# EAGLE design Un_C8051F340_V2.0 (EAGLE 6.6.0)
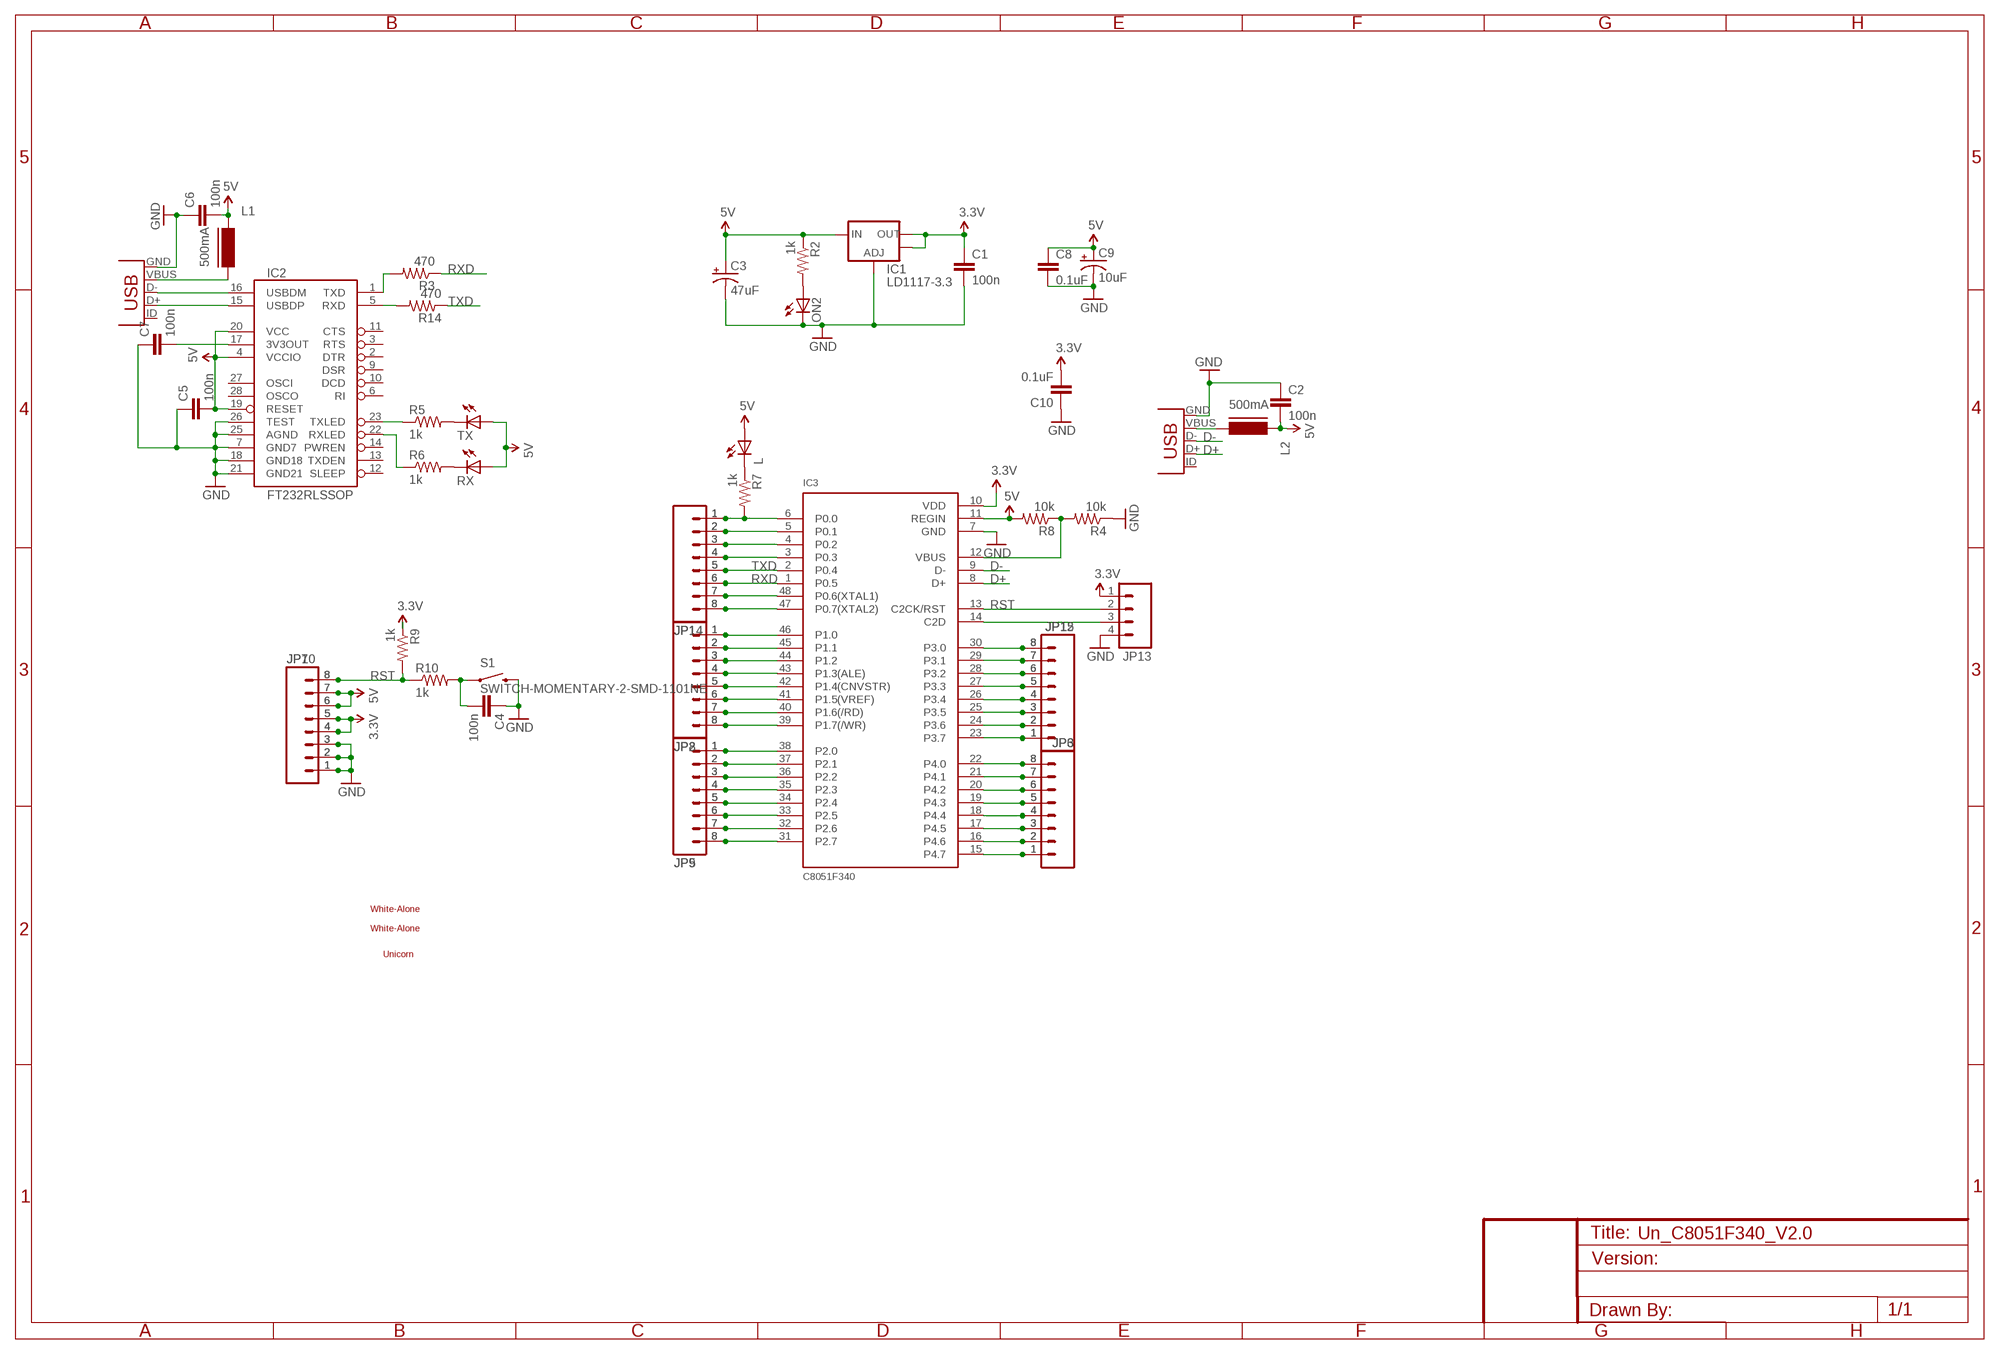
[diagram p0: schematic, sheet 1]

## Parts
C1  100n  CAP0603-CAP  [0603-CAP]
C2  100n  CAP0603-CAP  [0603-CAP]
C3  47uF  CAP_POLD  [PANASONIC_D]
C4  100n  CAP0603-CAP  [0603-CAP]
C5  100n  CAP0603-CAP  [0603-CAP]
C6  100n  CAP0603-CAP  [0603-CAP]
C7  100n  CAP0603-CAP  [0603-CAP]
C8  0.1uF  CAP0603-CAP  [0603-CAP]
C9  10uF  CAP_POL1206  [EIA3216]
C10  0.1uF  CAP0603-CAP  [0603-CAP]
IC1  LD1117-3.3  V_REG_LM1117SOT223  [SOT223]
IC2  FT232RLSSOP  [SSOP28DB]
IC3  C8051F340  [TQFP48]
JP1  M08  [1X08]
JP2  M08  [1X08]
JP3  M08  [1X08]
JP5  M08  [1X08]
JP6  M08  [1X08]
JP7  M08  [1X08]
JP8  M08  [1X08]
JP9  M08  [1X08]
JP10  M08  [1X08]
JP12  M08  [1X08]
JP13  M04PTH  [1X04]
JP14  M08  [1X08]
JP15  M08  [1X08]
L  LED0805  [LED-0805]
L1  500mA  FERRITE-0805  [FB805]
L2  500mA  FERRITE-0805  [FB805]
ON2  LED0805  [LED-0805]
R2  1k  RESISTOR0603-RES  [0603-RES]
R3  470  RESISTOR0603-RES  [0603-RES]
R4  10k  RESISTOR0603-RES  [0603-RES]
R5  1k  RESISTOR0603-RES  [0603-RES]
R6  1k  RESISTOR0603-RES  [0603-RES]
R7  1k  RESISTOR0603-RES  [0603-RES]
R8  10k  RESISTOR0603-RES  [0603-RES]
R9  1k  RESISTOR0603-RES  [0603-RES]
R10  1k  RESISTOR0603-RES  [0603-RES]
R14  470  RESISTOR0603-RES  [0603-RES]
RX  LED0805  [LED-0805]
S1  SWITCH-MOMENTARY-2-SMD-1101NE  [TACTILE-SWITCH-1101NE]
TX  LED0805  [LED-0805]
U$3  UNICORN_2  [UNICORN_2]
U$7  WHITE-ALONE_0  [WHITE-ALONE_0]
U$11  WHITE-ALONE_0  [WHITE-ALONE_0]
X1  USBSMD  [USB-MINIB]
X2  USBSMD  [USB-MINIB]

## Nets
3.3V: C1.1 C10.2 IC1.2(OUT) IC1.4(OUT) IC3.10(VDD) JP7.4 JP7.5 JP10.4 JP10.5 JP13.1 R9.1
5V [usbvcc]: C2.2 C3.+ C5.2 C6.2 C8.1 C9.A(+) IC1.3(IN) IC2.4(VCCIO) IC2.19(RESET) IC2.20(VCC) IC3.11(REGIN) JP7.6 JP7.7 JP10.6 JP10.7 L1.1 L2.1 L.1(A) R2.1 R8.2 RX.1(A) TX.1(A)
D+: IC3.8(D+) X1.D+
D-: IC3.9(D-) X1.D-
GND [gnd]: C1.2 C2.1 C3.- C4.1 C5.1 C6.1 C7.1 C8.2 C9.C(-) C10.1 IC1.1(ADJ) IC2.7(GND7) IC2.18(GND18) IC2.21(GND21) IC2.25(AGND) IC2.26(TEST) IC3.7(GND) JP7.1 JP7.2 JP7.3 JP10.1 JP10.2 JP10.3 JP13.4 ON2.2(C) R4.1 S1.P$2 X1.GND X2.GND
MISO: IC3.41(P1.5(VREF)) JP2.6 JP8.6
MISO1: IC3.33(P2.5) JP5.6 JP9.6
MISO2: IC3.28(P3.2) JP12.6 JP15.6
MOSI: IC3.42(P1.4(CNVSTR)) JP2.5 JP8.5
MOSI1: IC3.34(P2.4) JP5.5 JP9.5
MOSI2: IC3.27(P3.3) JP12.5 JP15.5
N$1: IC3.6(P0.0) JP1.1 JP14.1 R7.2
N$2: IC3.5(P0.1) JP1.2 JP14.2
N$3: L1.2 X2.VBUS
N$4: IC3.12(VBUS) R4.2 R8.1
N$5: IC2.16(USBDM) X2.D-
N$6: IC2.15(USBDP) X2.D+
N$7: IC2.23(TXLED) R5.1
N$8: R5.2 TX.2(C)
N$9: R6.2 RX.2(C)
N$10: IC2.22(RXLED) R6.1
N$11: IC3.22(P4.0) JP3.8 JP6.8
N$12: IC3.4(P0.2) JP1.3 JP14.3
N$13: IC3.3(P0.3) JP1.4 JP14.4
N$14: IC3.48(P0.6(XTAL1)) JP1.7 JP14.7
N$15: IC3.21(P4.1) JP3.7 JP6.7
N$16: IC3.39(P1.7(/WR)) JP2.8 JP8.8
N$17: IC3.47(P0.7(XTAL2)) JP1.8 JP14.8
N$18: IC3.45(P1.1) JP2.2 JP8.2
N$19: IC3.46(P1.0) JP2.1 JP8.1
N$20: IC3.14(C2D) JP13.3
N$21: L.2(C) R7.1
N$22: C7.2 IC2.17(3V3OUT)
N$23: C4.2 R10.2 S1.P$1
N$24: IC3.17(P4.5) JP3.3 JP6.3
N$25: IC3.18(P4.4) JP3.4 JP6.4
N$26: IC3.19(P4.3) JP3.5 JP6.5
N$27: IC3.20(P4.2) JP3.6 JP6.6
N$28: ON2.1(A) R2.2
N$29: IC3.44(P1.2) JP2.3 JP8.3
N$30: IC3.31(P2.7) JP5.8 JP9.8
N$32: L2.2 X1.VBUS
N$33: IC3.36(P2.2) JP5.3 JP9.3
N$34: IC3.37(P2.1) JP5.2 JP9.2
N$35: IC2.5(RXD) R14.2
N$36: IC3.38(P2.0) JP5.1 JP9.1
N$37: IC2.1(TXD) R3.2
N$38: IC3.35(P2.3) JP5.4 JP9.4
N$42: IC3.30(P3.0) JP12.8 JP15.8
N$43: IC3.25(P3.5) JP12.3 JP15.3
N$44: IC3.24(P3.6) JP12.2 JP15.2
N$45: IC3.23(P3.7) JP12.1 JP15.1
N$46: IC3.26(P3.4) JP12.4 JP15.4
N$48: IC3.43(P1.3(ALE)) JP2.4 JP8.4
P4_6: IC3.16(P4.6) JP3.2 JP6.2
P4_7: IC3.15(P4.7) JP3.1 JP6.1
RST: IC3.13(C2CK/RST) JP7.8 JP10.8 JP13.2 R9.2 R10.1
RXD: IC3.1(P0.5) JP1.6 JP14.6 R3.1
SCK: IC3.40(P1.6(/RD)) JP2.7 JP8.7
SCK1: IC3.32(P2.6) JP5.7 JP9.7
SCK2: IC3.29(P3.1) JP12.7 JP15.7
TXD: IC3.2(P0.4) JP1.5 JP14.5 R14.1
Unconnected: IC2.2(DTR) IC2.3(RTS) IC2.6(RI) IC2.9(DSR) IC2.10(DCD) IC2.11(CTS) IC2.12(SLEEP) IC2.13(TXDEN) IC2.14(PWREN) IC2.27(OSCI) IC2.28(OSCO) X1.ID(USBID) X2.ID(USBID)

## Library data of the parts
C1 C5-C8 C10 = 2SparkFun:CAP: Capacitor Standard 0603 ceramic capacitor, and 0.1" leaded capacitor.
C2 C4 = 1SparkFun:CAP: Capacitor Standard 0603 ceramic capacitor, and 0.1" leaded capacitor.
C3 C9 = 2SparkFun:CAP_POL: Capacitor Polarized These are standard SMD and PTH capacitors. Normally 10uF, 47uF, and 100uF in electrolytic and tantalum varieties. Always verify the external diameter of the through hole cap, it varies with capacity, voltage, and manufacturer. The EIA devices should be standard.
IC1 = 1SparkFun:V_REG_LM1117: Voltage Regulator LM1117 Standard adjustable voltage regulator but in SMD form. Spark Fun Electronics SKU : COM-00595
IC2 = 1SparkFun:FT232RL: USB UART FT232RL 4th Generation USB UART (USB <-> Serial) Controller. Spark Fun Electronics SKU : COM-00650
IC3 = 2SparkFun:C8051F340: Full Speed USB Flash MCU
JP1-JP3 JP5-JP10 JP12 JP14 JP15 = 1SparkFun:M08: Header 8 Standard 8-pin 0.1" header. Use with straight break away headers (SKU : PRT-00116), right angle break away headers (PRT-00553), swiss pins (PRT-00743), machine pins (PRT-00117), and female headers (PRT-00115).
JP13 = 2SparkFun:M04: Header 4 Standard 4-pin 0.1" header. Use with straight break away headers (SKU : PRT-00116), right angle break away headers (PRT-00553), swiss pins (PRT-00743), machine pins (PRT-00117), and female headers (PRT-00115). Molex polarized connector foot print use with SKU : PRT-08231 with associated crimp pins and housings. 1MM SMD Version SKU: PRT-10208
L ON2 RX TX = 1SparkFun:LED: LEDs Standard schematic elements and footprints for 5mm, 3mm, 1206, and 0603 sized LEDs. 5mm - Spark Fun Electronics SKU : COM-00529 (and others)
L1 L2 = 2SparkFun:FERRITE: Ferrite bead in various packages
R2-R10 R14 = 2SparkFun:RESISTOR: Resistor Basic schematic elements and footprints for 0603, 1206, and PTH resistors.
S1 = 2SparkFun:SWITCH-MOMENTARY-2
U$3 = 2SparkFun:UNICORN
U$7 U$11 = 2SparkFun:WHITE-ALONE
X1 X2 = 2SparkFun:USB: USB Connectors USB-B-PTH is fully proven SKU : PRT-00139 USB-miniB is fully proven SKU : PRT-00587 USB-A-PCB is untested. USB-A-H is throughly reviewed, but untested. Spark Fun Electronics SKU : PRT-00437 USB-B-SMT is throughly reviewed, but untested. Needs silkscreen touching up. USB-A-S has not been used/tested USB-MB-H has not been used/tested

## Net classes
0 default: width 0.254 mm, clearance 0.254 mm
1 power: width 0.61 mm, drill 0.61 mm, clearance 0.254 mm
2 gnd: width 0.305 mm, drill 0.381 mm, clearance 0.254 mm
3 usbvcc: width 0.508 mm, drill 0.61 mm, clearance 0.254 mm
4 aref: width 0.406 mm, drill 0.61 mm, clearance 0.254 mm

## Board
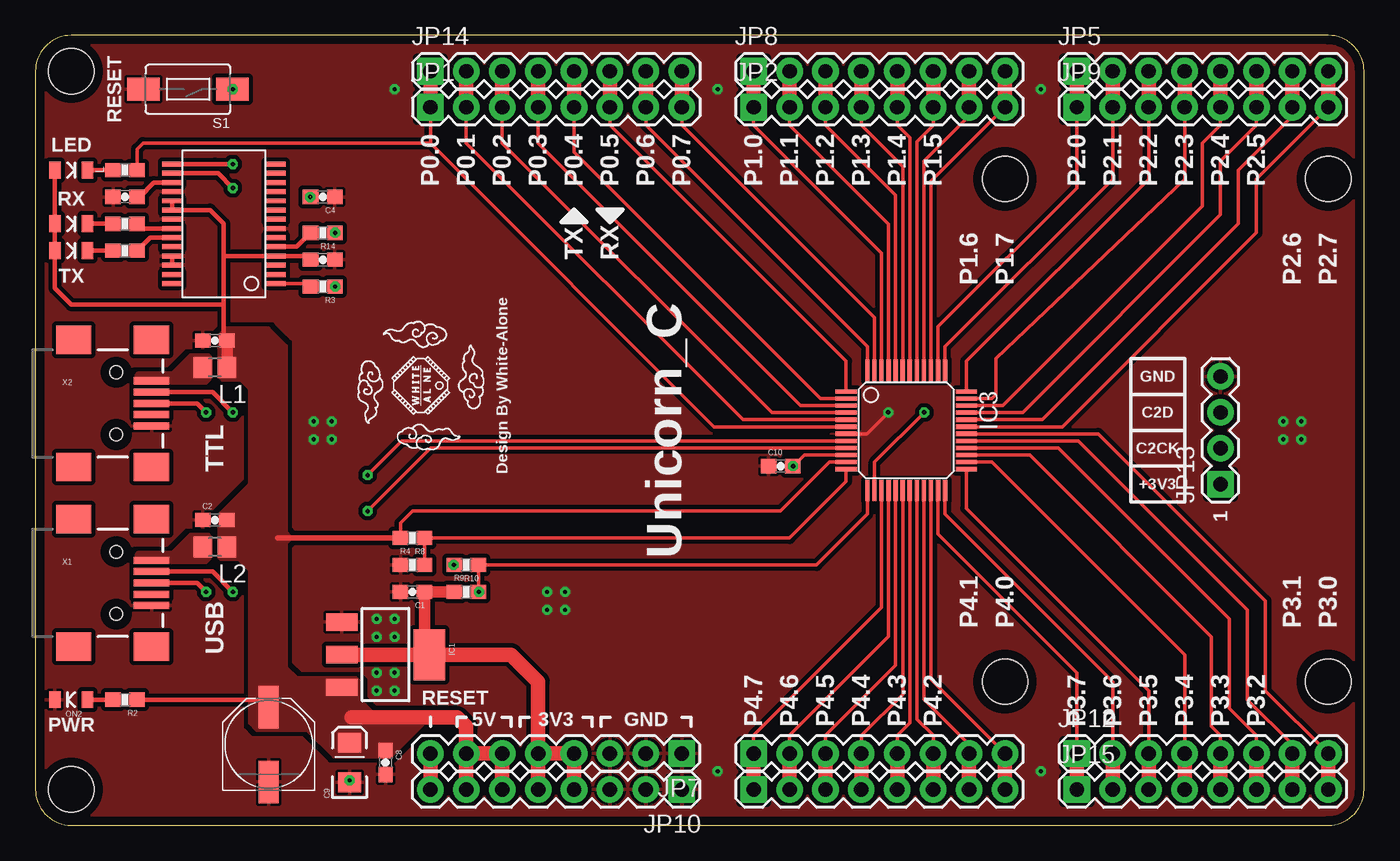
[diagram p1: board, top side]
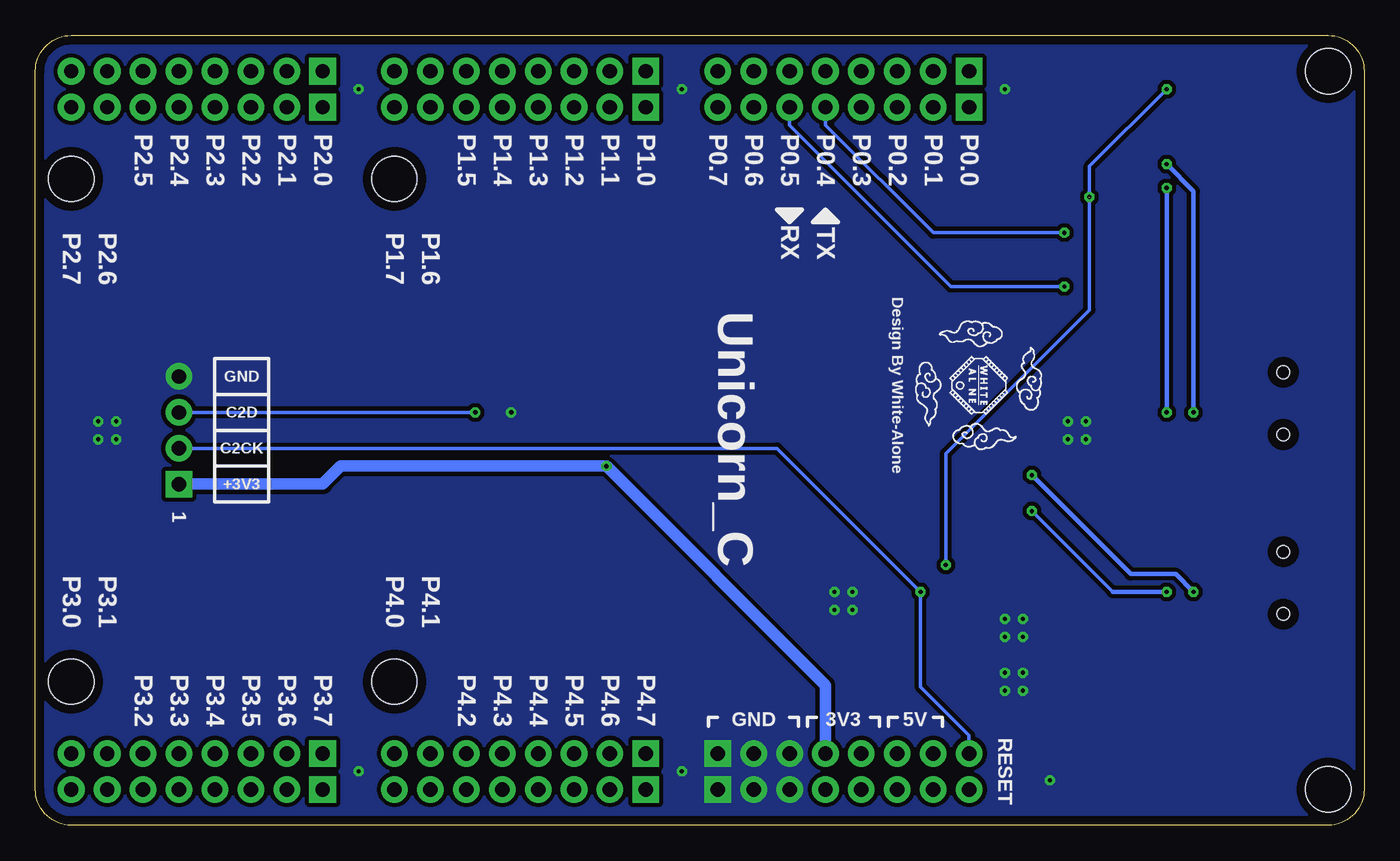
[diagram p2: board, bottom side, seen from below]

Size 93.98 x 55.88 mm. Coordinates in mm from the lower left corner, seen from the top.
Copper layers (1*16): Top 0.035mm / dielectric 1.5mm / Bottom 0.035mm
Design rules "yun": minimum track width 8mil, minimum drill 15mil, track to track 8mil, track to pad 8mil, pad to pad 8mil, via to via 8mil, smd to smd 8mil, copper to edge 25mil, drill to drill 8mil, minimum pad ring 10mil, minimum via ring 8mil, stop-mask expansion 4mil, vias tented up to drill 20mil, thermal gap 8mil

### Footprints (pad centres in the part's own frame; a part is rotated, then mirrored left to right if it is on the bottom)
0603-CAP = smd 1.1 x 1: 1 -0.85,0; 2 0.85,0
PANASONIC_D = smd 3 x 1.4: + 2.654,0; - -2.654,0
EIA3216 = smd 1.4 x 1.6: A 1.4,0; C -1.4,0
SOT223 = smd 1.219 x 2.235: 1 -2.311,-3.099; 2 0,-3.099; 3 2.311,-3.099 | smd 3.6 x 2.2: 4 0,3.099
SSOP28DB = smd 0.348 x 1.397: 1 -4.225,-3.656; 2 -3.575,-3.656; 3 -2.925,-3.656; 4 -2.275,-3.656; 5 -1.625,-3.656; 6 -0.975,-3.656; 7 -0.325,-3.656; 8 0.325,-3.656; 9 0.975,-3.656; 10 1.625,-3.656; 11 2.275,-3.656; 12 2.925,-3.656; 13 3.575,-3.656; 14 4.225,-3.656; 15 4.225,3.656; 16 3.575,3.656; 17 2.925,3.656; 18 2.275,3.656; 19 1.625,3.656; 20 0.975,3.656; 21 0.325,3.656; 22 -0.325,3.656; 23 -0.975,3.656; 24 -1.625,3.656; 25 -2.275,3.656; 26 -2.925,3.656; 27 -3.575,3.656; 28 -4.225,3.656
TQFP48 = smd 0.3 x 1.5: 1 -2.75,-4.25; 2 -2.25,-4.25; 3 -1.75,-4.25; 4 -1.25,-4.25; 5 -0.75,-4.25; 6 -0.25,-4.25; 7 0.25,-4.25; 8 0.75,-4.25; 9 1.25,-4.25; 10 1.75,-4.25; 11 2.25,-4.25; 12 2.75,-4.25; 25 2.75,4.25; 26 2.25,4.25; 27 1.75,4.25; 28 1.25,4.25; 29 0.75,4.25; 30 0.25,4.25; 31 -0.25,4.25; 32 -0.75,4.25; 33 -1.25,4.25; 34 -1.75,4.25; 35 -2.25,4.25; 36 -2.75,4.25 | smd 1.5 x 0.3: 13 4.25,-2.75; 14 4.25,-2.25; 15 4.25,-1.75; 16 4.25,-1.25; 17 4.25,-0.75; 18 4.25,-0.25; 19 4.25,0.25; 20 4.25,0.75; 21 4.25,1.25; 22 4.25,1.75; 23 4.25,2.25; 24 4.25,2.75; 37 -4.25,2.75; 38 -4.25,2.25; 39 -4.25,1.75; 40 -4.25,1.25; 41 -4.25,0.75; 42 -4.25,0.25; 43 -4.25,-0.25; 44 -4.25,-0.75; 45 -4.25,-1.25; 46 -4.25,-1.75; 47 -4.25,-2.25; 48 -4.25,-2.75
1X08 = drill 1.016 pad 1.88 square: 1 0,0 | drill 1.016 pad 1.88: 2 2.54,0; 3 5.08,0; 4 7.62,0; 5 10.16,0; 6 12.7,0; 7 15.24,0; 8 17.78,0
1X04 = drill 1 pad 1.88 square: 1 0,0 | drill 1 pad 1.88: 2 2.54,0; 3 5.08,0; 4 7.62,0
LED-0805 = smd 0.8 x 1.2: 1 -1.154,0; 2 1.154,0
FB805 = smd 1.3 x 1.5: 1 -0.85,0; 2 0.85,0
0603-RES = smd 1.1 x 1: 1 -0.85,0; 2 0.85,0
TACTILE-SWITCH-1101NE = smd 2.3 x 1.6: P$1 -3.15,0; P$2 3.15,0
UNICORN_2 = hole 3.2: -33.02,-25.4; 33.02,17.78; 33.02,-17.78; -33.02,25.4; 55.88,17.78; 55.88,-17.78
USB-MINIB = smd 2.5 x 0.5: D+ 2.5,0; D- 2.5,0.8; GND 2.5,-1.6; ID 2.5,-0.8; VBUS 2.5,1.6 | smd 2.5 x 2: MTN1 -3,4.5; MTN2 2.5,4.5; MTN3 -3,-4.5; MTN4 2.5,-4.5 | hole 0.9: 0,2.2; 0,-2.2

### Placement (x,y rotation side)
C1  26.67,16.51 180 top
C2  12.7,21.59 0 top
C3  16.51,5.71 90 top
C4  20.32,44.45 180 top
C5  20.32,40.01 180 top
C6  12.7,34.29 0 top
C7  6.35,44.45 0 top
C8  24.77,4.45 270 top
C9  22.23,4.45 90 top
C10  52.7,25.4 0 top
IC1  24.77,12.06 270 top
IC2  13.34,42.55 90 top
IC3  61.59,27.94 270 top
JP1  27.94,50.8 0 top
JP2  50.8,50.8 0 top
JP3  50.8,2.54 0 top
JP5  73.66,53.34 0 top
JP6  50.8,5.08 0 top
JP7  45.72,5.08 180 top
JP8  50.8,53.34 0 top
JP9  73.66,50.8 0 top
JP10  45.72,2.54 180 top
JP12  73.66,5.08 0 top
JP13  83.82,24.13 90 top
JP14  27.94,53.34 0 top
JP15  73.66,2.54 0 top
L  2.54,46.35 0 top
L1  12.7,32.38 180 top
L2  12.7,19.68 180 top
ON2  2.54,8.89 180 top
R2  6.35,8.89 180 top
R3  20.32,38.1 180 top
R4  26.67,18.41 0 top
R5  6.35,40.64 180 top
R6  6.35,42.55 180 top
R7  6.35,46.35 0 top
R8  26.67,20.32 180 top
R9  30.48,16.51 0 top
R10  30.48,18.41 180 top
R14  20.32,41.91 180 top
RX  2.54,42.55 0 top
S1  10.79,52.07 180 top
TX  2.54,40.64 0 top
U$3  35.56,27.94 0 top
U$7  27.3,31.11 90 top
U$11  27.3,31.11 270 bottom
X1  5.71,17.14 0 top
X2  5.71,29.84 0 top

### Tracks (layer width: path | path; a pad name or v marks a point on that pad's centre or on a via)
3.3V  (via drill 0.3)
  Top 0.254: C10.2 v53.59,25.4 54.38,26.19 IC3.10
  Top 0.813: 27.3,12.06 27.52,12.28 C1.1 R9.1
  Top 1.016: IC1.2 27.3,12.06 IC1.4 33.66,12.06 35.56,10.16 JP7.5 | JP7.5 JP7.4 JP10.4 | JP10.5 JP7.5
  Bottom 0.813: JP13.1 73.66,24.13 72.39,25.4 v53.59,25.4 38.1,9.91 JP7.4
5V
  Top 0.254: IC3.11 56.17,25.69 52.7,22.23 26.67,22.23 25.82,21.38 R8.2
  Top 0.305: C5.2 19.2,40.27 IC2.4 13.34,40.27 | IC2.19 IC2.20 12.36,43.52 13.34,42.55 13.34,40.27 | L.1 RX.1 TX.1 1.39,37.98 2.54,36.83 13.34,36.83 | 13.34,40.27 13.34,36.83 | 13.34,36.83 13.34,34.51 C6.2 | R2.1 15.99,8.89 C3.+
  Top 0.406: R8.2 17.14,20.32
  Top 0.813: L1.1 C6.2
  Top 1.016: JP10.6 JP7.6 JP7.7 | JP10.7 JP7.7 | JP7.7 30.48,6.99 29.84,7.62 22.35,7.62
  pour Top (isolate 0.305, no thermals): 15.62,6.73 19.18,6.73 21.08,4.83 25.15,4.83 27.81,7.49 27.81,8 23.88,8 23.11,8.76 23.11,10.03 22.73,10.41 18.54,10.41 17.78,11.18 17.78,19.94 18.03,20.19 18.03,20.45 17.78,20.7 17.78,33.91 16.51,35.18 13.46,35.18 12.95,34.67 12.95,31.75 13.21,31.5 14.48,31.5 15.11,30.86 15.11,24.13 12.95,21.97 12.95,18.92 13.08,18.8 14.35,18.8 15.11,18.03 15.11,7.24
D+  (via drill 0.3)
  Top 0.254: IC3.8 25.92,27.19 v23.5,24.77
  Top 0.305: X1.D+ 11.43,17.14 v12.06,16.51
  Bottom 0.305: v12.06,16.51 13.34,17.78 16.51,17.78 v23.5,24.77
D-  (via drill 0.3)
  Top 0.254: IC3.9 27.96,26.69 v23.5,22.23
  Top 0.305: X1.D- 12.54,17.95 v13.97,16.51
  Bottom 0.254: 17.78,16.51 v23.5,22.23
  Bottom 0.305: v13.97,16.51 17.78,16.51
GND  (via drill 0.3)
  Top 0.254: IC3.7 58.8,27.69 v60.33,29.21
  Top 0.305: IC2.25 IC2.26
  other vias: 22.23,3.17 24.13,13.34 25.4,13.34 24.13,10.79 25.4,10.79 24.13,14.61 25.4,14.61 24.13,9.53 25.4,9.53 25.4,52.07 88.27,28.57 88.27,27.3 19.68,27.3 20.95,27.3 20.95,28.57 19.68,28.57 89.53,27.3 89.53,28.57 48.26,52.07 71.12,52.07 71.12,3.81 48.26,3.81 36.2,16.51 37.47,16.51 36.2,15.24 37.47,15.24
  pour Bottom (isolate 0.305, rank 2, no thermals): 0,0 93.98,0 93.98,55.88 0,55.88
  pour Top (isolate 0.305, rank 2): 0,0 93.98,0 93.98,55.88 0,55.88
MISO
  Top 0.254: IC3.41 62.34,48.38 63.5,49.53 JP2.6
  Top 1.016: JP2.6 JP8.6
MISO1
  Top 0.254: IC3.33 69.83,29.19 83.82,43.18 83.82,46.99 86.36,49.53 JP9.6
  Top 1.016: JP9.6 JP5.6
MISO2
  Top 0.254: IC3.28 72.37,26.69 84.45,14.61 84.45,8.26 86.36,6.35 JP12.6
  Top 1.016: JP15.6 JP12.6
MOSI
  Top 0.254: IC3.42 61.84,48.65 60.96,49.53 JP2.5
  Top 1.016: JP2.5 JP8.5
MOSI1
  Top 0.254: JP9.5 83.82,49.53 82.55,48.26 82.55,43.81 68.42,29.69 IC3.34
  Top 1.016: JP9.5 JP5.5
MOSI2
  Top 0.254: IC3.27 70.33,26.19 83.19,13.34 83.19,6.99 83.82,6.35 JP12.5
  Top 1.016: JP15.5 JP12.5
N$1
  Top 0.254: IC3.6 48.01,28.19 27.94,48.26 | 27.94,48.26 JP1.1 | R7.2 7.2,47.84 7.62,48.26 27.94,48.26
  Top 1.016: JP14.1 JP1.1
N$2
  Top 0.254: IC3.5 50.05,28.69 30.48,48.26 JP1.2
  Top 1.016: JP1.2 JP14.2
N$3
  pour Top (isolate 0.305, no thermals): 7.09,31.29 12.12,31.29 12.37,31.55 12.4,33.15 12.27,33.27 10.92,33.27 9.65,32 7.24,32 7.09,31.8
N$4
  Top 0.254: R4.2 R8.1 53.34,20.32 57.34,24.32 IC3.12
N$5  (via drill 0.3)
  Top 0.305: X2.D- 12.54,30.64 v13.97,29.21 | IC2.16 12.94,46.12 v13.97,45.09
  Bottom 0.305: v13.97,29.21 v13.97,45.09
N$6  (via drill 0.3)
  Top 0.305: X2.D+ 11.43,29.84 v12.06,29.21 | IC2.15 12.69,46.77 v13.97,46.76
  Bottom 0.305: v12.06,29.21 12.06,44.86 v13.97,46.76
N$7
  Top 0.305: IC2.23 8.13,41.57 R5.1
N$8
  Top 0.305: TX.2 R5.2
N$9
  Top 0.305: RX.2 R6.2
N$10
  Top 0.305: IC2.22 7.53,42.22 R6.1
N$11
  Top 0.254: IC3.22 63.34,10.31 JP6.8
  Top 1.016: JP3.8 JP6.8
N$12
  Top 0.254: IC3.4 52.09,29.19 33.02,48.26 JP1.3
  Top 1.016: JP14.3 JP1.3
N$13
  Top 0.254: IC3.3 54.13,29.69 35.56,48.26 JP1.4
  Top 1.016: JP1.4 JP14.4
N$14
  Top 0.254: IC3.48 58.84,33.87 43.18,49.53 JP1.7
  Top 1.016: JP1.7 JP14.7
N$15
  Top 0.254: IC3.21 62.84,8.91 66.04,5.71 JP6.7
  Top 1.016: JP3.7 JP6.7
N$16
  Top 0.254: IC3.39 63.34,45.56 JP2.8
  Top 1.016: JP2.8 JP8.8
N$17
  Top 0.254: IC3.47 59.34,35.91 45.72,49.53 JP1.8
  Top 1.016: JP1.8 JP14.8
N$18
  Top 0.254: IC3.45 60.34,42.52 53.34,49.53 JP2.2
  Top 1.016: JP2.2 JP8.2
N$19
  Top 0.254: IC3.46 59.84,40.48 50.8,49.53 JP2.1
  Top 1.016: JP2.1 JP8.1
N$20  (via drill 0.3)
  Top 0.254: IC3.14 59.34,25.69 v62.87,29.21
  Bottom 0.254: v62.87,29.21 JP13.3
N$21
  Top 0.305: L.2 R7.1
N$22
  Top 0.305: C7.2 7.37,44.45 8.38,45.47 IC2.17
N$23  (via drill 0.3)  (2 unrouted)
  Top 0.254: R10.2 v29.59,18.41
  Bottom 0.254: v29.59,18.41 29.59,26.29 19.43,36.45 v19.43,44.45 19.43,46.61 v13.97,52.07
N$24
  Top 0.254: IC3.17 60.84,11.31 55.88,6.35 JP6.3
  Top 1.016: JP3.3 JP6.3
N$25
  Top 0.254: IC3.18 61.34,9.28 58.42,6.35 JP6.4
  Top 1.016: JP3.4 JP6.4
N$26
  Top 0.254: IC3.19 61.84,7.24 60.96,6.35 JP6.5
  Top 1.016: JP3.5 JP6.5
N$27
  Top 0.254: IC3.20 62.34,7.5 63.5,6.35 JP6.6
  Top 1.016: JP3.6 JP6.6
N$28
  Top 0.305: ON2.1 R2.2
N$29
  Top 0.254: IC3.44 60.84,44.56 55.88,49.53 JP2.3
  Top 1.016: JP2.3 JP8.3
N$30
  Top 0.254: JP9.8 86.36,45.72 86.36,41.91 72.64,28.19 IC3.31
  Top 1.016: JP9.8 JP5.8
N$32
  pour Top (isolate 0.305, no thermals): 7.09,18.59 12.12,18.59 12.37,18.85 12.4,20.45 12.27,20.57 10.92,20.57 9.65,19.3 7.24,19.3 7.09,19.1
N$33
  Top 0.254: IC3.36 65.84,32.83 78.74,45.72 JP9.3
  Top 1.016: JP9.3 JP5.3
N$34
  Top 0.254: IC3.37 64.34,33.87 76.2,45.72 JP9.2
  Top 1.016: JP9.2 JP5.2
N$35
  Top 0.305: IC2.5 18.48,40.92 R14.2
N$36
  Top 0.254: JP9.1 73.66,45.09 63.84,35.27 IC3.38
  Top 1.016: JP9.1 JP5.1
N$37
  Top 0.254: IC2.1 19.25,38.32 R3.2
N$38
  Top 0.254: IC3.35 67.66,30.19 67.94,30.48 67.94,33.02 81.28,45.72 JP9.4
  Top 1.016: JP9.4 JP5.4
N$42
  Top 0.254: IC3.30 75.18,27.69 87,15.88 87,9.53 JP12.8
  Top 1.016: JP15.8 JP12.8
N$43
  Top 0.254: IC3.25 65.84,22.42 78.74,9.53 JP12.3
  Top 1.016: JP15.3 JP12.3
N$44
  Top 0.254: IC3.24 64.34,22.02 76.2,10.16 76.2,4.45
  Top 1.016: JP15.2 76.2,4.45 JP12.2
N$45
  Top 0.254: JP12.1 73.66,10.79 63.84,20.61 IC3.23
  Top 1.016: JP15.1 JP12.1
N$46
  Top 0.254: IC3.26 67.66,25.69 81.28,12.06 JP12.4
  Top 1.016: JP15.4 JP12.4
N$48
  Top 0.254: IC3.43 61.34,46.6 58.42,49.53 JP2.4
  Top 1.016: JP2.4 JP8.4
P4_6
  Top 0.254: IC3.16 60.34,13.36 53.34,6.35 JP6.2
  Top 1.016: JP3.2 JP6.2
P4_7
  Top 0.254: IC3.15 59.84,15.39 50.8,6.35 JP6.1
  Top 1.016: JP3.1 JP6.1
RST  (via drill 0.3)
  Top 0.254: v31.37,16.51 R9.2 R10.1 55.24,18.41 58.84,22.02 IC3.13
  Top 1.016: JP10.8 JP7.8
  Bottom 0.254: JP7.8 27.94,6.35 31.37,9.78 v31.37,16.51 41.53,26.67 JP13.2
RXD  (via drill 0.3)
  Top 0.254: R3.1 v21.21,38.1 | IC3.1 57.34,32.83 40.64,49.53 JP1.6
  Top 1.016: JP1.6 JP14.6
  Bottom 0.254: v21.21,38.1 29.21,38.1 40.64,49.53 JP1.6
SCK
  Top 0.254: IC3.40 62.84,46.97 66.04,50.16 JP2.7
  Top 1.016: JP2.7 JP8.7
SCK1
  Top 0.254: JP9.7 88.9,50.16 85.09,46.35 85.09,42.55 71.23,28.69 IC3.32
  Top 1.016: JP9.7 JP5.7
SCK2
  Top 0.254: IC3.29 73.78,27.19 85.72,15.24 85.72,8.89 88.9,5.71 JP12.7
  Top 1.016: JP15.7 JP12.7
TXD  (via drill 0.3)
  Top 0.254: IC3.2 55.53,30.19 38.1,47.62 JP1.5 | R14.1 v21.21,41.91
  Top 1.016: JP14.5 JP1.5
  Bottom 0.254: v21.21,41.91 30.48,41.91 38.1,49.53 JP1.5

### Text on the board
tPlace: RESET | P0.0 | P0.1 | P0.2 | P0.3 | P0.4 | P0.5 | P0.6 | P0.7 | P1.0 | P1.1 | P1.2 | P1.3 | P1.4 | P1.5 | P2.0 | P2.1 | P2.2 | P2.3 | P2.4 | P2.5 | LED | RX | P1.6 | P1.7 | P2.6 | P2.7 | TX | RX | TX | GND | Design By White-Alone | C2D | Unicorn_C | TTL | C2CK | +3V3 | 1 | USB | P4.1 | P4.0 | P3.1 | P3.0 | RESET | PWR | 5V | 3V3 | GND | P4.7 | P4.6 | P4.5 | P4.4 | P4.3 | P4.2 | P3.7 | P3.6 | P3.5 | P3.4 | P3.3 | P3.2
bPlace: P0.0 | P0.1 | P0.2 | P0.3 | P0.4 | P0.5 | P0.6 | P0.7 | P1.0 | P1.1 | P1.2 | P1.3 | P1.4 | P1.5 | P2.0 | P2.1 | P2.2 | P2.3 | P2.4 | P2.5 | P1.6 | P1.7 | P2.6 | P2.7 | TX | RX | GND | Design By White-Alone | C2D | Unicorn_C | C2CK | +3V3 | 1 | P4.1 | P4.0 | P3.1 | P3.0 | 5V | 3V3 | GND | P4.7 | P4.6 | P4.5 | P4.4 | P4.3 | P4.2 | P3.7 | P3.6 | P3.5 | P3.4 | P3.3 | P3.2 | RESET